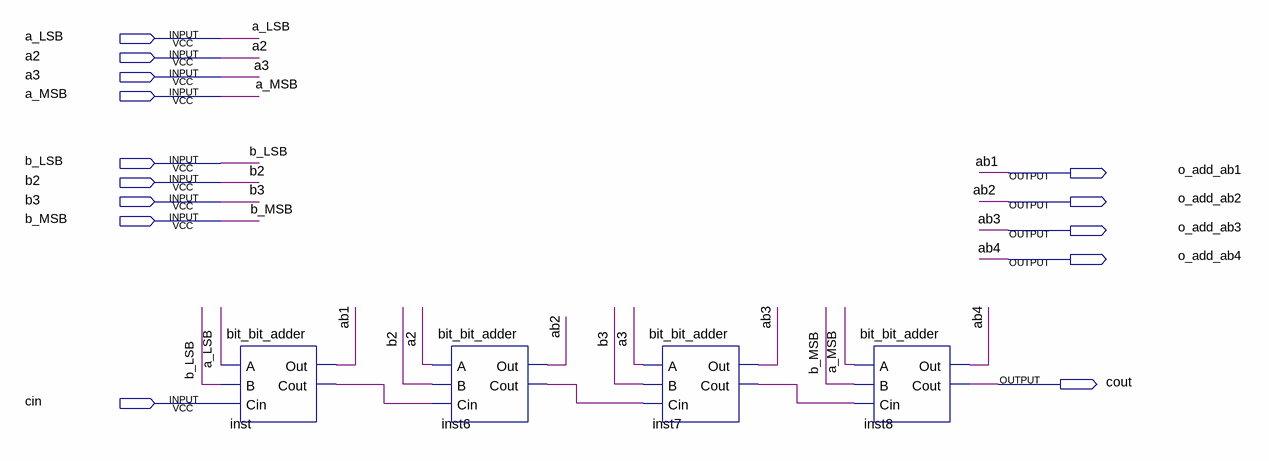
[diagram p0: schematic sheet]
// Quartus schematic full_adder.bdf as structural Verilog: 4 symbols, 14 pins
module full_adder (
  input  a_LSB,
  input  a2,
  input  a3,
  input  a_MSB,
  input  b_LSB,
  input  b2,
  input  b3,
  input  b_MSB,
  input  cin,
  output o_add_ab1,
  output o_add_ab2,
  output o_add_ab3,
  output o_add_ab4,
  output cout
);

  wire inst6_cout, inst7_cout, inst_cout;

  bit_bit_adder inst (.A(a_LSB), .B(b_LSB), .Cin(cin), .Out(o_add_ab1), .Cout(inst_cout));
  bit_bit_adder inst6 (.A(a2), .B(b2), .Cin(inst_cout), .Out(o_add_ab2), .Cout(inst6_cout));
  bit_bit_adder inst7 (.A(a3), .B(b3), .Cin(inst6_cout), .Out(o_add_ab3), .Cout(inst7_cout));
  bit_bit_adder inst8 (.A(a_MSB), .B(b_MSB), .Cin(inst7_cout), .Out(o_add_ab4), .Cout(cout));

  // Other names for the same wires on the sheet: ab1 = o_add_ab1; ab2 = o_add_ab2; ab3 = o_add_ab3; ab4 = o_add_ab4
endmodule
